# EasyEDA Pro project 2轴4.0--(02-06).eprj, board 2X-4.6-V3
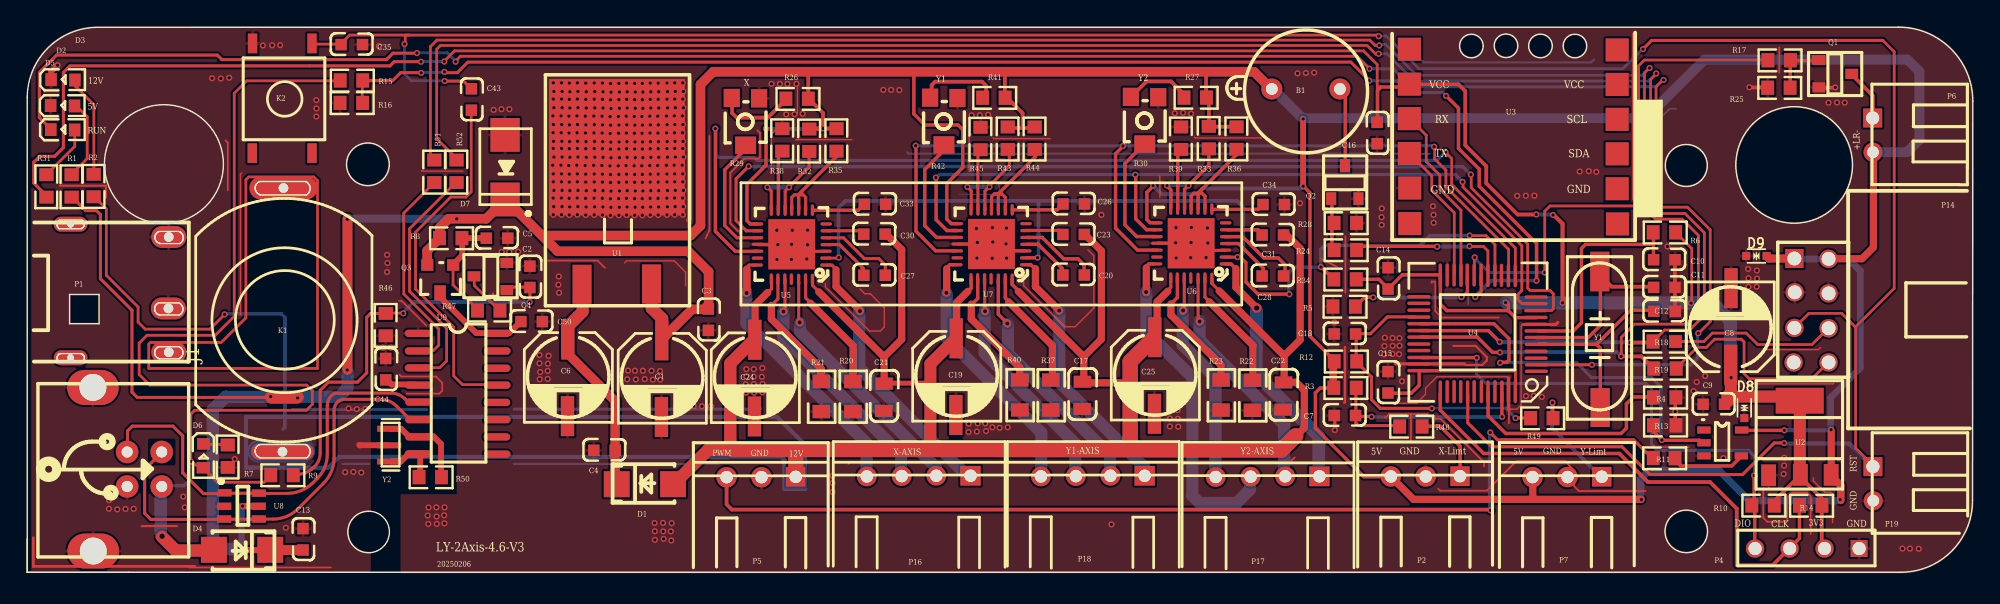
[diagram p1: board, top side]
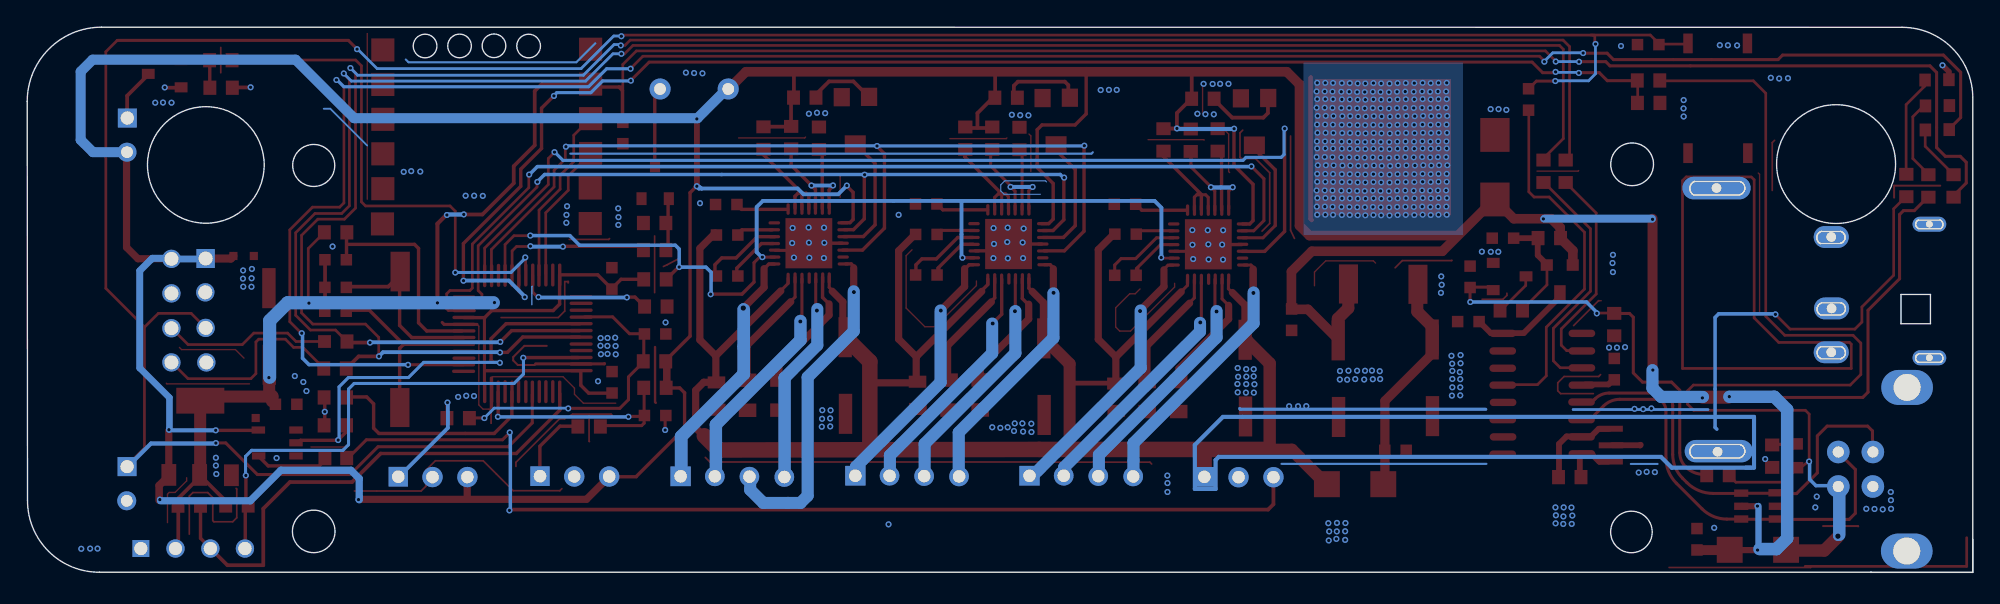
[diagram p2: board, bottom side, seen from below]

Outline 142.95 x 40.12 mm; copper layers: Top Layer, Bottom Layer. Coordinates in mm from the lower left corner of the outline.
Outline path: circle c10.04,30.05 r4.37 ; circle c25.03,30.03 r1.57 ; circle c25.08,2.97 r1.53 ; circle c106.11,38.73 r0.87 ; circle c108.65,38.75 r0.87 ; circle c111.18,38.74 r0.87 ; circle c113.72,38.73 r0.87 ; circle c121.9,29.95 r1.55 ; circle c121.9,3.02 r1.56 ; circle c129.83,29.98 r4.29 ; 0,2.47 0,0.01 137.66,0.01 arc(141.38,1.55) 142.93,5.28 142.95,34.66 arc(141.35,38.52) 137.49,40.12 5.2,40.11 arc(1.52,38.59) 0,34.91 0,0 7.49,0 7.49,0 ; 3.11,20.45 5.28,20.45 5.28,18.3 3.11,18.3 3.11,20.45
Stack: Top Layer 0.0356mm / Dielectric1 0.32mm FR-4 er 4.8 / Bottom Layer 0.0356mm

## Design rules (mm)
net R1: Top Side Components
net R2: Top Side Components
net R31: Top Side Components
net D3: Top Side Components
net D2: Top Side Components
net D5: Top Side Components
net P1: Top Side Components
net K1: Top Side Components
net K2: Top Side Components
net J1: Top Side Components
net D6: Top Side Components
net R7: Top Side Components
net R9: Top Side Components
net U8: Top Side Components
net D4: Top Side Components
net C13: Top Side Components
net Y2: Top Side Components
net R50: Top Side Components
net U9: Top Side Components
net C44: Top Side Components
net R46: Top Side Components
net Q3: Top Side Components
net Q4: Top Side Components
net R47: Top Side Components
net R8: Top Side Components
net R51: Top Side Components
net R52: Top Side Components
net C2: Top Side Components
net C5: Top Side Components
net C50: Top Side Components
net U1: Top Side Components
net D7: Top Side Components
net C43: Top Side Components
net C35: Top Side Components
net R15: Top Side Components
net R16: Top Side Components
net C6: Top Side Components
net C1: Top Side Components
net C24: Top Side Components
net C19: Top Side Components
net C25: Top Side Components
net C8: Top Side Components
net U5: Top Side Components
net U7: Top Side Components
net U6: Top Side Components
net U4: Top Side Components
net Y1: Top Side Components
net D1: Top Side Components
net C4: Top Side Components
net P5: Top Side Components
net P16: Top Side Components
net P18: Top Side Components
net P17: Top Side Components
net P2: Top Side Components
net P7: Top Side Components
net P4: Top Side Components
net P19: Top Side Components
net R10: Top Side Components
net R14: Top Side Components
net U2: Top Side Components
net P14: Top Side Components
net P6: Top Side Components
net Q1: Top Side Components
net U3: Top Side Components
net C3: Top Side Components
net R40: Top Side Components
net R37: Top Side Components
net R22: Top Side Components
net R23: Top Side Components
net C17: Top Side Components
net C22: Top Side Components
net C21: Top Side Components
net R20: Top Side Components
net R21: Top Side Components
net C27: Top Side Components
net C30: Top Side Components
net C33: Top Side Components
net C20: Top Side Components
net C23: Top Side Components
net C26: Top Side Components
net C28: Top Side Components
net C31: Top Side Components
net C34: Top Side Components
net C14: Top Side Components
net C18: Top Side Components
net C7: Top Side Components
net C15: Top Side Components
net C16: Top Side Components
net C9: Top Side Components
net C10: Top Side Components
net C11: Top Side Components
net C12: Top Side Components
net Q2: Top Side Components
net R29: Top Side Components
net R42: Top Side Components
net R30: Top Side Components
net B1: Top Side Components
net R26: Top Side Components
net R35: Top Side Components
net R38: Top Side Components
net R32: Top Side Components
net R44: Top Side Components
net R45: Top Side Components
net R41: Top Side Components
net R43: Top Side Components
net R27: Top Side Components
net R39: Top Side Components
net R33: Top Side Components
net R36: Top Side Components
net R28: Top Side Components
net R24: Top Side Components
net R34: Top Side Components
net R5: Top Side Components
net R12: Top Side Components
net R3: Top Side Components
net R48: Top Side Components
net R49: Top Side Components
net R18: Top Side Components
net R19: Top Side Components
net R4: Top Side Components
net R13: Top Side Components
net R11: Top Side Components
net U10: Top Side Components
net R6: Top Side Components
net R17: Top Side Components
net R25: Top Side Components
template: 用户自定义配置
spacing Clearance (default): track to track 0.201, other pairs 0.201 to 0.201
track width Width (default): min 0.1, default 0.254, max 10
differential pair DiffPairsRouting (default): width min 0.381, default 0.381, max 0.381; gap min 0.254, default 0.254
via RoutingVias (default): diameter min 1.27, default 1.27, max 1.27; hole min 0.711, default 0.711, max 0.711

## Placement (name value [footprint] x y rotation side)
B1  蜂鸣器  [B1]  92 35.62 0 top
C1  100uf 35v  [C1]  46.85 16.29 0 top
C2  104/50v 0603  [C13]  36.76 20.79 0 top
C3  -  [C13]  49.87 17.63 0 top
C4  104/50V 0603  [C13]  43.38 8.81 90 top
C5  103/50V 0603  [C13]  35.49 24.42 90 top
C6  100uf/35V  [C1]  39.95 16.35 0 top
C7  103/50V 0603  [C13]  97.78 11.37 90 top
C8  100uf/35V  [C1]  124.94 16.07 180 top
C9  -  [C13]  124.89 12.19 90 top
C10  -  [C13]  121.25 22.83 90 top
C11  -  [C13]  121.25 20.8 90 top
C12  -  [C13]  121.26 19.04 90 top
C13  -  [C13]  20.09 1.47 0 top
C14  104/50v 0603  [C13]  99.81 20.67 0 top
C15  104/50v 0603  [C13]  99.8 13.02 0 top
C16  104/50v 0603  [C13]  99.01 31.37 0 top
C17  105/50V 0805  [C17]  77.35 13.35 0 top
C18  103/50V 0603  [C13]  97.78 17.37 90 top
C19  100uf/35V  [C1]  68.48 16.44 0 top
C20  104/50v 0603  [C13]  77.85 21.71 90 top
C21  105/50V 0805  [C17]  62.78 13.21 0 top
C22  105/50V 0805  [C17]  92.13 13.29 0 top
C23  104/50v 0603  [C13]  77.85 24.69 90 top
C24  100uf/35V  [C1]  53.69 16.33 0 top
C25  100uf/35V  [C1]  83.08 16.52 0 top
C26  224/25V 0603  [C13]  77.86 26.93 90 top
C27  104/50v 0603  [C13]  63.23 21.69 90 top
C28  104/50v 0603  [C13]  92.49 21.63 90 top
C30  104/50v 0603  [C13]  63.21 24.71 90 top
C31  104/50v 0603  [C13]  92.49 24.65 90 top
C33  224/25V 0603  [C13]  63.26 26.91 90 top
C34  224/25V 0603  [C13]  92.55 26.89 90 top
C35  -  [C13]  24.81 38.66 90 top
C43  -  [C13]  32.46 33.84 0 top
C44  -  [C13]  26.16 13.99 0 top
C50  104/50v 0603  [C13]  38.03 18.28 90 top
D1  SS54/SMA  [D4]  47.4 6.67 180 top
D2  LED-R/0603  [D3]  3.65 34.43 0 top
D3  LED-R/0603  [D3]  3.68 36.33 0 top
D4  SS54/SMA  [D4]  13.77 1.48 0 top
D5  LED-G/0603  [D3]  3.66 32.66 0 top
D6  LED-R/0603  [D3]  13.03 7.52 270 top
D7  AE/SMB  [D7]  34.7 30.62 0 top
D8  PESD3V3L1BA-N  [SOD-523_L1.2-W0.8-LS1.6-BI]  126.16 12.11 90 top
D9  PESD5V0L1BA-N  [SOD-523_L1.2-W0.8-LS1.6-BI]  127.05 23.28 0 top
J1  4P USB  [J1]  9.73 9.8 0 top
K1  KAN-9A  [K1]  17.58 27.5 0 top
K2  6*6*11  [K2]  16.66 32.63 0 top
NOREF  -  [Pad_ie24]  18.67 8.92 180 top
P1  DC044A  [P1]  10.42 24.1 0 top
P2  3P  [P5]  104.76 6.75 0 top
P4  4P  [P4]  133.53 1.58 0 top
P5  3P  [P5]  55.95 6.7 0 top
P6  XH2.54-2P-90  [P19]  136.68 33.54 0 top
P7  3P  [P5]  115.18 6.71 0 top
P14  DC3-8P  [J10]  130.47 21.42 0 top
P16  4P  [P16]  68.75 6.22 0 top
P17  4P  [P16]  94.38 6.18 0 top
P18  4P  [P16]  81.54 6.22 0 top
P19  XH2.54-2P-90  [P19]  136.7 7.88 0 top
Q1  MMBT5551/SOT-23  [Q4]  131.67 37.55 180 top
Q2  MMBT5551/SOT-23  [Q4]  95.96 27.53 270 top
Q3  MMBT5401/SOT-23  [Q3]  30.51 22.24 0 top
Q4  MMBT5551/SOT-23  [Q4]  35.21 20.92 0 top
R1  1K/0603  [R31#2]  3.24 27.36 0 top
R2  2K/0603  [R31#2]  4.86 27.39 0 top
R3  -  [R31#2]  97.91 13.56 90 top
R4  -  [R31#2]  121.39 12.85 90 top
R5  -  [R31#2]  97.84 19.54 90 top
R6  -  [R31#2]  121.37 25 90 top
R7  1K/0603  [R31#2]  14.71 7.47 0 top
R8  10K/0603  [R31#2]  32.19 24.57 90 top
R9  2K/0603  [R31#2]  19.8 7.13 90 top
R10  -  [R31#2]  128.62 4.9 90 top
R11  100R/0603  [R31]  121.33 8.38 90 top
R12  -  [R31#2]  97.94 15.5 90 top
R13  2K/0603  [R31#2]  121.39 10.8 90 top
R14  -  [R31#2]  132.12 4.89 90 top
R15  5.1K/0603  [R31#2]  24.9 36.17 90 top
R16  -  [R31#2]  24.89 34.52 90 top
R17  2K/0603  [R31#2]  129.8 37.67 90 top
R18  100R/0603  [R31#3]  121.36 16.97 90 top
R19  100R/0603  [R31#2]  121.41 14.98 90 top
R20  R100/0805  [R40]  60.66 13.92 0 top
R21  R100/0805  [R40]  58.35 13.92 0 top
R22  R100/0805  [R40]  90.02 14.01 0 top
R23  R100/0805  [R40]  87.71 14.02 0 top
R24  2K/0603  [R31#2]  97.93 23.7 90 top
R25  -  [R31#2]  129.78 35.64 90 top
R26  30K/0603  [R31#2]  57.65 34.83 90 top
R27  30K/0603  [R31#2]  86.9 34.91 90 top
R28  -  [R31#2]  97.93 25.69 90 top
R29  3*3 10K  [R29]  54.66 34.81 0 top
R30  3*3 10K  [R29]  83.99 34.89 0 top
R31  1K/0603  [R31#2]  1.39 27.36 0 top
R32  -  [R31#2]  57.44 30.72 0 top
R33  -  [R31#2]  86.79 30.91 0 top
R34  -  [R31#2]  97.91 21.54 90 top
R35  100R/0603  [R31#2]  59.44 30.74 0 top
R36  100R/0603  [R31#2]  88.83 30.88 0 top
R37  R100/0805  [R40]  75.22 14.02 0 top
R38  10K/0603  [R31#2]  55.46 30.74 0 top
R39  10K/0603  [R31#2]  84.75 30.87 0 top
R40  R100/0805  [R40]  72.93 14.03 0 top
R41  30K/0603  [R31#2]  72.1 34.9 90 top
R42  3*3 10K  [R29]  69.24 34.83 0 top
R43  -  [R31#2]  72.02 30.87 0 top
R44  100R/0603  [R31#2]  74 30.87 0 top
R45  10K/0603  [R31#2]  70.02 30.85 0 top
R46  10K/0603  [R31#2]  26.32 17.16 0 top
R47  2K/0603  [R31#2]  34.99 19.25 90 top
R48  470R/0603  [R31#2]  102.74 10.71 90 top
R49  470R/0603  [R31#2]  112.36 11.32 90 top
R50  1M/0603  [R31#2]  30.69 6.98 90 top
R51  100R/0603  [R31#2]  29.89 28.44 0 top
R52  100R/0603  [R31#2]  31.52 28.44 0 top
U1  7805/TO263-3  [U1]  40.46 20.44 0 top
U2  1117-3.3/SOT-223  [U2]  128.18 7 0 top
U3  JY230  [U3]  101.73 38.24 0 top
U4  GD32F303CCT6  [U4]  110.99 14.98 0 top
U5  HR4988  [U5]  58.43 21.91 0 top
U6  HR4988  [U5]  87.78 21.99 0 top
U7  HR4988  [U5]  73.11 21.93 0 top
U8  UL26-SOT23-6  [U8]  14.37 6.21 0 top
U9  CH340G/SOP-16  [U9]  29.36 17.34 0 top
U10  74LVC1G17/SOT23-5  [V10]  123.78 10.22 0 top
Y1  8M/HC49S  [Y1]  114.99 20.94 0 top
Y2  12M  [Y2]  26.91 8.23 0 top

## Footprints (pads in the part's own frame, mm; a bottom-side part is the same pattern mirrored in y, then rotated)
B1
  round 1.548 hole 0.864: 1(-0.559,-0.051) 2(4.445,-0.051)
C1
  rect 0.984x2.949 smd: 1(-0.229,0.787) 2(-0.254,-4.851)
C13
  rect 0.848x0.848 smd: 1(0.178,0.178) 2(0.178,1.752)
C17
  rect 1.294x0.887 smd: 1(0.178,0.686) 2(0.152,-1.321)
D3
  rect 0.848x0.949 smd: 1(-0.178,-0.102) 2(-1.931,-0.076)
D4
  rect 1.903x1.915 smd: 1(-0.051,0.178) 2(4.09,0.178)
D7
  rect 2.152x2.492 smd: 1(0.406,1.575) 2(0.406,-3.175)
J1
  round 1.661 hole 0.813: 1(0.152,-3.48) 2(0.152,-0.94) 3(-2.388,-0.94) 4(-2.388,-3.48)
  oval 3.794x2.575 hole 1.981: 5(-4.902,3.81) 6(-4.877,-8.229)
J10
  rect 1.345x1.395 hole 1.016: 1(-0.635,1.677)
  round 1.345 hole 1.016: 2(1.879,1.651) 3(-0.61,-0.813) 4(1.879,-0.889) 5(-0.635,-3.429) 6(1.879,-3.454) 7(-0.686,-5.969) 8(1.879,-5.969)
K1
  oval 5.013x1.661 hole 0.711: 1(1.244,0.787)
  oval 4.6x1.2 hole 0.711: 2(1.169,-18.618)
K2
  rect 0.695x1.457 smd: 1(-0.127,-1.778) 2(4.267,-1.778) 3(4.267,6.299) 4(-0.102,6.299)
P1
  oval 2.575x1.609 hole 0.711: 1(-0.025,-7.899) 2(-0.051,-4.673) 3(-0.025,0.584)
  oval 2.473x1.101 hole 0.508: 4(-7.239,1.524) 5(-7.239,-8.306)
P4
  rect 1.243x1.243 hole 0.965: 1(1.067,0.178)
  round 1.345 hole 0.965: 2(-1.473,0.178) 3(-4.038,0.178) 4(-6.579,0.178)
P5
  rect 1.419x1.446 hole 0.914: 1(0.508,0.33)
  round 1.497 hole 0.914: 2(-2.006,0.305) 3(-4.572,0.305)
P16
  rect 1.497x1.446 hole 0.914: 1(0.559,0.889)
  round 1.446 hole 0.914: 2(-1.956,0.889) 3(-4.496,0.864) 4(-7.061,0.838)
P19
  rect 1.395x1.395 hole 0.965: 1(-1.092,-0.102)
  round 1.395 hole 0.864: 2(-1.067,-2.616)
Pad_ie24
  oval 5.002x1.649 smd far side: 6(0,0)
Q3
  rect 0.893x0.848 smd: 1(0.787,0.381) 2(-1.117,0.381)
  rect 0.848x1.147 smd: 3(-0.178,-1.677)
Q4
  rect 0.944x0.746 smd: 1(0.025,-0.152) 2(0.025,1.854) 3(-2.388,0.864)
R29
  rect 1.192x1.345 smd: 1(-0.889,0.076) 2(-2.896,0.102)
  rect 1.548x1.294 smd: 3(-1.879,-3.378)
R31
  rect 1.051x0.949 smd: 1(0.025,0.254) 2(0.036,1.852)
R31#2
  rect 1.051x0.949 smd: 1(0.025,0.254) 2(0.025,1.905)
R31#3
  rect 0.94x0.949 smd: 1(0.025,0.254)
  rect 1.051x0.949 smd: 2(0.025,1.905)
R40
  rect 1.294x0.989 smd: 1(0,0.127) 2(0,-2.083)
SOD-523_L1.2-W0.8-LS1.6-BI
  rect 0.6x0.6 smd: 1(-0.75,0) 2(0.75,0)
U1
  rect 1.401x2.88 smd: 1(0.305,0.762) 3(5.41,0.787)
  rect 9.986x10.043 smd: 2(2.87,10.846)
U2
  rect 1.091x1.599 smd: 1(-0.229,0.152) 2(2.108,0.178) 3(4.369,0.178)
  rect 3.529x1.903 smd: 4(2.058,5.639)
U3
  rect 1.7x1.7 smd: 1(-0.178,0.254) 2(-0.178,-2.312) 3(-0.178,-4.851) 4(-0.178,-7.417) 5(-0.152,-9.957) 6(-0.152,-12.573) 7(15.113,-12.598) 8(15.088,-10.008) 9(15.088,-7.442) 10(15.088,-4.902) 11(15.088,-2.337) 12(15.088,0.203)
U4
  oval 1.7x0.25 smd: 1(-0.102,-0.178) 2(-0.102,0.305) 3(-0.127,0.787) 4(-0.127,1.296) 5(-0.102,1.804) 6(-0.127,2.312) 7(-0.127,2.794) 8(-0.127,3.276) 9(-0.127,3.784) 10(-0.152,4.293) 11(-0.127,4.801) 12(-0.127,5.283) 25(-8.738,5.309) 26(-8.738,4.826) 27(-8.738,4.318) 28(-8.738,3.81) 29(-8.738,3.328) 30(-8.738,2.82) 31(-8.738,2.337) 32(-8.738,1.829) 33(-8.738,1.346) 34(-8.738,0.838) 35(-8.738,0.355) 36(-8.738,-0.127)
  oval 0.25x1.7 smd: 13(-1.651,6.858) 14(-2.159,6.858) 15(-2.667,6.883) 16(-3.15,6.883) 17(-3.658,6.883) 18(-4.165,6.909) 19(-4.673,6.909) 20(-5.181,6.909) 21(-5.639,6.883) 22(-6.147,6.909) 23(-6.655,6.909) 24(-7.163,6.909) 37(-7.163,-1.702) 38(-6.655,-1.677) 39(-6.147,-1.677) 40(-5.664,-1.677) 41(-5.156,-1.702) 42(-4.673,-1.677) 43(-4.14,-1.677) 44(-3.658,-1.702) 45(-3.15,-1.677) 46(-2.642,-1.702) 47(-2.159,-1.677) 48(-1.651,-1.677)
U5
  oval 0.85x0.24 smd: 1(0.254,0.711) 2(0.254,1.219) 3(0.254,1.727) 4(0.28,2.21) 5(0.28,2.718) 6(0.28,3.226) 7(0.28,3.734) 15(-4.775,3.734) 16(-4.775,3.226) 17(-4.775,2.718) 18(-4.775,2.235) 19(-4.775,1.727) 20(-4.775,1.219) 21(-4.801,0.711)
  oval 0.24x0.85 smd: 8(-0.737,4.75) 9(-1.244,4.75) 10(-1.752,4.75) 11(-2.26,4.75) 12(-2.743,4.75) 13(-3.251,4.75) 14(-3.759,4.75) 22(-3.759,-0.33) 23(-3.276,-0.33) 24(-2.768,-0.33) 25(-2.286,-0.33) 26(-1.752,-0.355) 27(-1.244,-0.33) 28(-0.737,-0.355)
  rect 3.441x3.695 smd: 29(-2.26,2.235)
U8
  rect 1.04x0.543 smd: 1(0.127,-0.355) 2(0.102,-1.346) 3(0.102,-2.286) 4(2.642,-2.286) 5(2.642,-1.346) 6(2.642,-0.381)
U9
  oval 1.96x0.543 smd: 1(-0.635,0.254) 2(-0.635,-1.042) 3(-0.635,-2.286) 4(-0.635,-3.556) 5(-0.61,-4.801) 6(-0.61,-6.096) 7(-0.61,-7.366) 8(-0.635,-8.611) 9(5.181,-8.636) 10(5.156,-7.366) 11(5.181,-6.096) 12(5.156,-4.826) 13(5.181,-3.556) 14(5.181,-2.312) 15(5.181,-1.042) 16(5.181,0.254)
V10
  rect 0.989x0.531 smd: 1(-0.584,0.254) 2(-0.584,-0.686) 3(-0.584,-1.651) 4(2.159,-1.651) 5(2.184,0.254)
Y1
  rect 1.419x2.919 smd: 1(0.559,1.194)
  rect 1.419x2.869 smd: 2(0.584,-8.814)
Y2
  rect 1.8x0.441 smd: 1(-0.305,-0.076) 2(-0.33,1.117) 3(-0.305,2.337)

## Nets
V10-1: U10.1
D3-2: C1.2 C2.2 C3.1 C4.2 C5.1 C6.2 C7.2 C8.2 C9.2 C10.1 C11.1 C12.1 C13.2 C14.2 C15.2 C16.1 C17.2 C18.2 C19.2 C21.2 C22.2 C24.2 C25.2 C26.1 C33.1 C34.1 C35.1 C44.2 C50.1 D2.2 D3.2 D7.1 D8.1 D9.1 J1.4 J1.5 J1.6 K2.4 P1.2 P1.3 P2.2 P4.1 P5.2 P7.2 P14.3 P14.4 P19.2 Q1.2 Q2.2 Q4.2 R4.1 R5.2 R7.1 R13.1 R16.2 R20.2 R21.2 R22.2 R23.2 R25.2 R28.1 R29.1 R30.1 R37.2 R38.2 R39.2 R40.2 R42.1 R45.2 R46.1 U1.2 U2.1 U3.5 U4.8 U4.23 U4.35 U4.47 U5.3 U5.18 U5.29 U6.3 U6.18 U6.29 U7.3 U7.18 U7.29 U8.2 U9.1 U10.3 Y2.2
D5-2: D5.2 U4.2
D6-2: D6.2 R7.2
J1-1: J1.1 U8.3 U8.4 U9.6
J1-2: D4.1 D6.1 J1.2 R9.2 R15.2
J1-3: J1.3 U8.1 U8.6 U9.5
K2-1: K2.1
K2-2: K2.2
K2-3: C35.2 C43.2 K2.3 P14.5 P19.1 U4.41
P1-1: K1.1 P1.1
P1-4: P1.4
P1-5: P1.5
P2-1: P2.1 R48.1
P5-3: P5.3 R11.2
P6-1: P6.1 Q1.3
P7-1: P7.1 R49.1
P14-6: P14.6 R18.1
P14-7: P14.7
P14-8: P14.8 R19.1
Q1-1: Q1.1 R17.1 R25.1
Q2-1: Q2.1 R24.2 R28.2
Q2-3: B1.2 Q2.3
Q3-1: C5.2 Q3.1 R8.1 R47.2
Q4-3: Q4.3 R47.1
R1-1: B1.1 C1.1 C3.2 C13.1 D4.2 D7.2 D9.2 P2.3 P6.2 P7.3 P14.1 P14.2 Q3.2 R1.1 R3.2 R8.2 R12.2 R26.1 R27.1 R32.2 R33.2 R35.2 R36.2 R41.1 R43.2 R44.2 U1.3 U2.3 U5.15 U6.15 U7.15 U8.5 U10.5
R1-2: D2.1 R1.2
R2-1: C17.1 C19.1 C21.1 C22.1 C23.1 C24.1 C25.1 C30.1 C31.1 D1.1 K1.2 NOREF.6 P5.1 R2.1 U5.22 U5.28 U6.22 U6.28 U7.22 U7.28
R2-2: D3.1 R2.2
R9-1: C2.1 Q4.1 R9.1 R46.2
R15-1: R15.1 R16.1 U4.18
R29-2: R26.2 R29.2
R30-2: R27.2 R30.2
R31-1: C8.1 C9.1 C14.1 C15.1 C16.2 D8.2 P4.2 R6.1 R10.1 R14.1 R31.1 R34.1 U2.2 U2.4 U3.2 U4.9 U4.24 U4.36 U4.48
R31-2: D5.1 R31.2
R42-2: R41.2 R42.2
R51-2: R19.2 R51.2 U4.31
R52-2: R18.2 R52.2 U4.30
U1-1: C4.1 C6.1 D1.2 U1.1
U3-1: U3.1
U3-6: U3.6
U3-7: U3.7
U3-8: U3.8
U3-9: U3.9
U3-10: U3.10
U3-11: U3.11
U3-12: U3.12
U4-1: U4.1
U4-3: U4.3
U4-4: U4.4
U4-5: C12.2 U4.5 Y1.2
U4-6: C11.2 U4.6 Y1.1
U4-7: C10.2 R6.2 U4.7
U4-12: U4.12
U4-15: U4.15
U4-17: R24.1 U4.17
U4-19: R17.2 U4.19
U4-20: R5.1 U4.20
U4-21: U3.3 U4.21
U4-22: U3.4 U4.22
U4-25: U4.25
U4-26: U4.26
U4-27: U4.27
U4-28: C18.1 R12.1 R49.2 U4.28
U4-29: R13.2 U4.29 U10.2
U4-32: U4.32
U4-33: U4.33
U4-34: P4.4 R10.2 U4.34
U4-37: P4.3 R14.2 U4.37
U4-38: U4.38
U4-39: U4.39
U4-40: U4.40
U4-42: U4.42
U4-43: U4.43
U4-44: R4.2 U4.44
U4-45: U4.45
U4-46: C7.1 R3.1 R48.2 U4.46
U5-1: P16.1 U5.1
U5-2: R34.2 U4.16 U5.2 U6.2 U7.2
U5-4: C27.2 U5.4
U5-5: C27.1 U5.5
U5-6: C30.2 U5.6
U5-7: U5.7
U5-8: C33.2 U5.8
U5-9: R35.1 U5.9 U5.10 U5.11
U5-12: R32.1 U5.12 U5.14
U5-13: R38.1 U5.13
U5-16: U4.10 U5.16
U5-17: R29.3 U5.17
U5-19: U4.13 U5.19
U5-20: U5.20
U5-21: P16.4 U5.21
U5-23: R21.1 U5.23
U5-24: P16.3 U5.24
U5-25: U5.25
U5-26: P16.2 U5.26
U5-27: R20.1 U5.27
U6-1: P17.1 U6.1
U6-4: C28.2 U6.4
U6-5: C28.1 U6.5
U6-6: C31.2 U6.6
U6-7: U6.7
U6-8: C34.2 U6.8
U6-9: R36.1 U6.9 U6.10 U6.11
U6-12: R33.1 U6.12 U6.14
U6-13: R39.1 U6.13
U6-17: R30.3 U6.17
U6-20: U6.20
U6-21: P17.3 U6.21
U6-23: R23.1 U6.23
U6-24: P17.4 U6.24
U6-25: U6.25
U6-26: P17.2 U6.26
U6-27: R22.1 U6.27
U7-1: P18.1 U7.1
U7-4: C20.2 U7.4
U7-5: C20.1 U7.5
U7-6: C23.2 U7.6
U7-7: U7.7
U7-8: C26.2 U7.8
U7-9: R44.1 U7.9 U7.10 U7.11
U7-12: R43.1 U7.12 U7.14
U7-13: R45.1 U7.13
U7-16: U4.11 U6.16 U7.16
U7-17: R42.3 U7.17
U7-19: U4.14 U6.19 U7.19
U7-20: U7.20
U7-21: P18.4 U7.21
U7-23: R40.1 U7.23
U7-24: P18.3 U7.24
U7-25: U7.25
U7-26: P18.2 U7.26
U7-27: R37.1 U7.27
U9-2: R51.1 U9.2
U9-3: R52.1 U9.3
U9-4: C44.1 U9.4
U9-9: U9.9
U9-10: U9.10
U9-11: U9.11
U9-12: U9.12
U9-13: C43.1 U9.13
U9-14: U9.14
U9-15: U9.15
U9-16: C50.2 Q3.3 U9.16
UNNAMEDNET1: R11.1 U10.4
Y2-1: R50.2 U9.8 Y2.1
Y2-3: R50.1 U9.7 Y2.3

## Via types
v1: diameter 0.45, hole 0.25, Top Layer to Bottom Layer, 597 vias
v2: diameter 0.7, hole 0.4, Top Layer to Bottom Layer, 2 vias
v3: diameter 0.6, hole 0.3, Top Layer to Bottom Layer, 11 vias

## Routing (per net, layer and track width the routed paths; a pad name or vN(x,y) marks a point on that pad's centre or on a via; arc(x,y) is an arc through that point)
D3-2: length 431.8
  Top Layer w0.074: 117.95,39.66 117.96,39.64
  Top Layer w0.099: 48.37,21.09 48.37,22.1 47.54,22.92 44.04,22.92 43.88,22.76 ; 15.76,29.39 15.67,29.29 15.67,18.94 ; 70.96,31.97 71.02,31.92 75.16,31.92 ; 77.94,23.74 78.37,23.3 78.37,19.45 77,18.08 76.23,18.08 73.21,21.1 73.21,21.44 ; 83.2,29.18 83.22,29.16 83.22,27.6 ; 90.68,31.97 85.82,31.97 85.76,32.04 ; 61.19,20.86 61.55,20.5 61.95,20.5 62.97,19.47 62.97,18.06 62.68,17.76 61.88,17.76 58.64,21 58.64,21.27 ; 32.02,29.53 29,29.53 28.96,29.57 ; 60.59,31.84 56.51,31.84 56.48,31.81 ; 56.54,35.94 56.59,35.89 56.59,33.78 ; 54.6,29.42 54.68,29.5 54.68,32.26 55.12,32.7 ; 109.9,18.25 109.77,18.12 109.77,12.32 109.46,12.01 109.02,12.01 108.86,11.85 108.86,10.96 108.86,12.06 ; 69.21,29.51 69.21,32.12 69.35,32.26 ; 27.3,19.99 27.47,19.99
  Top Layer w0.1: 99.71,12.45 102.08,12.45 102.74,13.11 102.74,13.56 103.58,14.4 108.74,14.4 108.84,14.3 ; 127.02,15.77 127.65,16.39 131.61,16.39 131.77,16.55 ; 132.64,3.66 132.64,5.76 132.52,5.88 132.08,5.88 131.24,6.73 131.24,6.96 ; 122.1,9.23 119.64,9.23 119.5,9.37 ; 132.73,13.92 132.69,13.87 126.62,13.87 ; 117.96,27.46 117.96,39.64
  Top Layer w0.124: 27.88,13.16 30.28,13.16 30.49,13.37 30.49,13.95 30.03,14.41 27.49,14.41 27.35,14.55 ; 100.16,24.56 100.23,24.5 103.13,24.5 ; 38.27,22.97 38.29,22.94 41.91,22.94 42.44,22.42 ; 14.57,31.79 14.73,31.62 14.73,28.11 ; 11.8,0.48 11.92,0.36 22.31,0.36 ; 103.2,21.4 103.45,21.4 103.45,19.23 103.93,18.75 108.13,18.75 ; 95.08,23.08 95.93,22.64 96.21,22.51 ; 27.47,19.99 27.5,19.99 29.33,18.16 ; 50.13,32.11 50.13,25.18 49.84,24.57 ; 53.64,32.54 53.84,32.34 53.84,30.55 53.73,30.45 52.7,30.45 51.66,29.41 51.66,25.67 52.22,25.11 ; 36.05,20.1 34.52,20.1 34.23,20.38 34.23,20.54 ; 96.85,20.58 96.85,24.75
  Top Layer w0.126: 127.6,6.18 127.55,6.13 127.55,4.02 127.85,3.73 129.23,3.73 129.32,3.81 129.32,5.5 129.69,5.87 130.78,5.87 131.04,5.61 131.04,2.81 ; 101.67,11.61 101.67,9.65 101.64,9.63 ; 128.73,36.77 128.73,38.63 ; 118.91,5.99 114.01,5.99 113.67,6.33 113.67,7.5 112.96,8.21 109.45,8.21 108.48,7.25 107.24,6.01 103.81,6.01 103.67,6.16 ; 60.33,7.98 60.47,8.11 67.84,8.11 67.85,8.12 92.79,8.12 93.13,8.46 ; 99.79,11.38 100.05,11.65 102.87,11.65 103.47,11.3 103.84,11.3 107.04,8.1 107.04,7.8
  Top Layer w0.149: 104.78,16.67 106.42,16.67 107.24,15.84 107.24,15.6 106.91,15.26 105.68,15.26 105.59,15.35 ; 11,3.41 8.44,3.41 8.42,3.39 ; 2.39,28.46 5.78,28.46 5.78,27.58 ; 103.2,21.31 103.2,21.4
  Top Layer w0.174: 96.77,12.48 96.82,12.53 96.82,16.58
  Top Layer w0.2: 12.31,0.44 0.45,0.44 0.45,2.55
  Top Layer w0.226: 109.9,18.25 112.32,18.25 112.46,18.39 ; 105.59,15.35 100.55,15.35 100.53,15.37 ; 96.08,11.49 96.08,10.5 96.04,10.46 ; 86.62,23.7 87.99,23.7 ; 108.84,12.09 108.86,12.06 ; 57.55,23.63 58.64,23.63
  Top Layer w0.251: 121.13,10.9 121.09,10.95 121.09,12.75 ; 53.71,24.12 54.89,24.12 ; 83.07,24.22 84.13,24.22 ; 72.13,23.66 73.29,23.66 ; 108.84,12.09 108.84,14.3 ; 68.41,24.16 69.75,24.16
  Top Layer w0.276: 127.77,35.69 126.57,35.69 126.57,35.69 ; 121.07,19.13 121.07,22.91 ; 131.75,35.67 132.86,35.67
  Top Layer w0.301: 48.56,25.92 48.65,26.01
  Top Layer w0.327: 48.65,26.01 48.65,36.43
  Top Layer w0.4: v1(2.23,37.32) 1.75,36.84 1.75,36.26
  Top Layer w0.428: 26.49,9.36 24.45,9.36 24.44,9.34 24.4,9.39
  Bottom Layer w0.073: 68.05,28.73 68.13,28.81 71.12,28.81 71.42,28.52 71.42,28.07 71.17,27.82 68.5,27.82
  Bottom Layer w0.099: 105.87,19.71 105.87,21.02 105.85,21.05
  Bottom Layer w0.124: 121.17,34.12 120.68,34.12 117.97,31.41
  Bottom Layer w0.149: 115.13,37.74 114.93,37.54 102.6,37.54 101.21,38.94 ; 64.66,30.91 64.76,30.81 103.04,30.81 ; 23.17,7.98 25.12,7.98 ; 35.73,7.99 50.79,7.99
  Bottom Layer w0.2: 19.46,11.98 29.36,11.98
  Bottom Layer w0.226: 53.87,12.06 53.81,12 35.79,12
  vias: v1(6.02,5.92) v1(6.01,5.31) v1(6,4.68) v1(6.62,4.64) v1(7.22,4.67) v1(7.82,4.68) v1(11.46,5.58) v1(11.57,4.78) v1(13.58,36.36) v1(14.23,36.34) v1(14.84,36.4) v1(15.25,8.34) v1(17.32,38.78) v1(17.99,38.79) v1(18.59,38.8) v1(19,3.28) v1(21.24,34.76) v1(21.25,34.14) v1(21.24,33.55) v1(23.36,7.38) v1(23.61,12.06) v1(23.96,7.4) v1(24.22,12.01) v1(24.55,7.34) v1(24.85,12.03) v1(25.55,16.57) v1(25.85,38.73) v1(26.14,16.54) v1(26.44,23.37) v1(26.47,22.76) v1(26.44,22.1) v1(26.73,16.54) v1(29.49,4.77) v1(29.42,4.18) v1(29.47,3.57) v1(30.06,4.78) v1(30.08,4.12) v1(30.09,3.57) v1(30.66,4.78) v1(30.63,4.2) v1(30.65,3.61) v1(34.27,34.04) v1(34.84,34.09) v1(34.86,23.59) v1(35.42,34.09) v1(35.41,23.59) v1(36.07,23.6) v1(37.64,15.99) v1(37.64,15.39) v1(37.66,14.21) v1(37.66,13.62) v1(37.66,13.03) v1(37.69,14.74) v1(38.25,15.36) v1(38.24,14.83) v1(38.24,14.23) v1(38.24,13.62) v1(38.27,13.01) v1(38.3,15.94) v1(38.65,36.03) v1(38.65,34.83) v1(38.62,33.59) v1(38.66,32.96) v1(38.63,32.35) v1(38.67,31.72) v1(38.65,31.2) v1(38.61,29.96) v1(38.65,29.33) v1(38.65,28.74) v1(38.64,27.55) v1(38.69,26.91) v1(38.65,26.32) v1(38.7,35.39) v1(38.7,34.19) v1(38.7,30.56) v1(38.7,28.11) v1(39.06,21.78) v1(39.02,21.17) v1(39.08,20.57) v1(39.26,36.03) v1(39.26,34.83) v1(39.22,33.59) v1(39.27,32.96) v1(39.23,32.35) v1(39.28,31.72) v1(39.26,31.2) v1(39.21,29.96) v1(39.26,29.33) v1(39.26,28.74) v1(39.25,27.55) v1(39.29,26.91) v1(39.26,26.32) v1(39.3,35.39) v1(39.3,34.19) v1(39.3,30.56) v1(39.3,28.11) v1(39.79,29.94) v1(39.83,36) v1(39.87,35.37) v1(39.83,34.81) v1(39.87,34.17) v1(39.8,33.57) v1(39.84,32.94) v1(39.81,32.33) v1(39.85,31.7) v1(39.83,31.18) v1(39.87,30.54) v1(39.83,29.31) v1(39.83,28.72) v1(39.87,28.09) v1(39.82,27.53) v1(39.86,26.89) v1(39.83,26.3) v1(40.38,29.96) v1(40.42,36.03) v1(40.46,35.39) v1(40.42,34.83) v1(40.46,34.19) v1(40.39,33.59) v1(40.43,32.96) v1(40.4,32.35) v1(40.44,31.72) v1(40.42,31.2) v1(40.46,30.56) v1(40.42,29.33) v1(40.42,28.74) v1(40.46,28.11) v1(40.41,27.55) v1(40.45,26.91) v1(40.42,26.32) v1(41.03,36) v1(41.08,35.37) v1(41.03,34.81) v1(41.08,34.17) v1(41,33.57) v1(41.05,32.94) v1(41.01,32.33) v1(41.06,31.7) v1(41.03,31.18) v1(41.08,30.54) v1(40.99,29.94) v1(41.03,29.31) v1(41.03,28.72) v1(41.08,28.09) v1(41.02,27.53) v1(41.07,26.89) v1(41.03,26.3) v1(41.66,36.02) v1(41.66,34.82) v1(41.63,33.58) v1(41.67,32.95) v1(41.64,32.34) v1(41.68,31.71) v1(41.66,31.19) v1(41.62,29.95) v1(41.66,29.32) v1(41.66,28.73) v1(41.65,27.54) v1(41.66,26.31) v1(41.7,35.38) v1(41.7,34.18) v1(41.7,30.55) v1(41.7,28.1) v1(41.69,26.9) v1(42.26,36) v1(42.26,34.81) v1(42.23,33.57) v1(42.27,32.94) v1(42.24,32.33) v1(42.28,31.7) v1(42.26,31.18) v1(42.22,29.94) v1(42.26,29.31) v1(42.26,28.72) v1(42.25,27.53) v1(42.26,26.3) v1(42.3,35.37) v1(42.3,34.17) v1(42.3,30.54) v1(42.3,28.09) v1(42.29,26.89) v1(42.85,35.97) v1(42.85,34.78) v1(42.82,33.54) v1(42.87,32.9) v1(42.83,32.3) v1(42.88,31.67) v1(42.85,31.15) v1(42.81,29.91) v1(42.85,29.27) v1(42.85,28.69) v1(42.84,27.5) v1(42.89,26.86) v1(42.85,26.27) v1(42.9,35.34) v1(42.9,34.14) v1(42.9,30.51) v1(42.9,28.06) v1(43.47,35.98) v1(43.47,34.79) v1(43.44,33.55) v1(43.48,32.91) v1(43.45,32.31) v1(43.47,31.16) v1(43.43,29.92) v1(43.47,29.28) v1(43.47,28.7) v1(43.46,27.51) v1(43.47,26.28) v1(43.51,35.35) v1(43.51,34.15) v1(43.49,31.68) v1(43.51,30.52) v1(43.51,28.07) v1(43.5,26.87) v1(43.57,14.81) v1(43.54,14.22) v1(44.04,36) v1(44.08,35.37) v1(44.04,34.81) v1(44.08,34.17) v1(44.01,33.57) v1(44.05,32.94) v1(44.02,32.33) v1(44.06,31.7) v1(44.04,31.18) v1(44.08,30.54) v1(44,29.94) v1(44.04,29.31) v1(44.04,28.72) v1(44.08,28.09) v1(44.03,27.53) v1(44.07,26.89) v1(44.04,26.3) v1(44.08,14.21) v1(44.15,14.85) v1(44.63,35.98) v1(44.67,35.35) v1(44.63,34.79) v1(44.67,34.15) v1(44.6,33.55) v1(44.64,32.91) v1(44.61,32.31) v1(44.65,31.68) v1(44.63,31.16) v1(44.67,30.52) v1(44.59,29.92) v1(44.63,29.28) v1(44.63,28.7) v1(44.67,28.07) v1(44.62,27.51) v1(44.66,26.87) v1(44.63,26.28) v1(44.65,14.84) v1(44.72,14.19) v1(45.16,33.55) v1(45.17,32.31) v1(45.15,29.92) v1(45.18,27.51) v1(45.19,35.98) v1(45.24,35.35) v1(45.19,34.79) v1(45.24,34.15) v1(45.2,32.91) v1(45.22,31.68) v1(45.19,31.16) v1(45.24,30.52) v1(45.19,29.28) v1(45.19,28.7) v1(45.24,28.07) v1(45.23,26.87) v1(45.19,26.28) v1(45.24,14.84) v1(45.37,14.22) v1(45.78,36) v1(45.78,34.81) v1(45.74,33.57) v1(45.79,32.94) v1(45.75,32.33) v1(45.78,31.18) v1(45.73,29.94) v1(45.78,29.31) v1(45.78,28.72) v1(45.77,27.53) v1(45.78,26.3) v1(45.82,35.37) v1(45.82,34.17) v1(45.8,31.7) v1(45.82,30.54) v1(45.82,28.09) v1(45.81,26.89) v1(45.87,14.84) v1(45.97,14.18) v1(46.09,3.63) v1(46.11,3.03) v1(46.11,2.39) v1(46.36,36) v1(46.36,34.81) v1(46.33,33.57) v1(46.37,32.94) v1(46.34,32.33) v1(46.38,31.7) v1(46.36,31.18) v1(46.32,29.94) v1(46.36,29.31) v1(46.36,28.72) v1(46.35,27.53) v1(46.36,26.3) v1(46.4,35.37) v1(46.4,34.17) v1(46.4,30.54) v1(46.4,28.09) v1(46.39,26.89) v1(46.5,14.82) v1(46.51,14.19) v1(46.72,3.64) v1(46.73,3.02) v1(46.76,2.47) v1(46.97,33.58) v1(46.98,32.34) v1(46.96,29.95) v1(47,36.02) v1(47.05,35.38) v1(47,34.82) v1(47.05,34.18) v1(47.01,32.95) v1(47.02,31.71) v1(47,31.19) v1(47.05,30.55) v1(47,29.32) v1(47,28.73) v1(47.05,28.1) v1(46.99,27.54) v1(47.03,26.9) v1(47,26.31) v1(47.35,3.62) v1(47.29,3.02) v1(47.32,2.35) v1(47.58,36.03) v1(47.58,34.83) v1(47.54,33.59) v1(47.59,32.96) v1(47.55,32.35) v1(47.58,31.2) v1(47.53,29.96) v1(47.58,29.33) v1(47.58,28.74) v1(47.56,27.55) v1(47.58,26.32) v1(47.62,35.39) v1(47.62,34.19) v1(47.6,31.72) v1(47.62,30.56) v1(47.62,28.11) v1(47.61,26.91) v1(48.17,36.03) v1(48.17,34.83) v1(48.14,33.59) v1(48.18,32.96) v1(48.15,32.35) v1(48.17,31.2) v1(48.12,29.96) v1(48.17,29.33) v1(48.17,28.74) v1(48.16,27.55) v1(48.17,26.32) v1(48.21,35.39) v1(48.21,34.19) v1(48.19,31.72) v1(48.21,30.56) v1(48.21,28.11) v1(48.2,26.91) v1(48.97,12.23) v1(49.58,12.22) v1(50.23,12.22) v1(52.78,13.84) v1(52.84,14.95) v1(52.84,14.42) v1(52.82,13.23) v1(53.39,14.95) v1(53.37,14.4) v1(53.39,13.85) v1(53.41,13.23) v1(53.98,14.39) v1(54.01,15.04) v1(54.03,13.86) v1(54.01,13.25) v1(54.69,35.95) v1(55.08,25.18) v1(55.15,24.12) v1(55.09,23.02) v1(55.3,35.95) v1(55.77,33.71) v1(55.85,35.94) v1(56.17,24.14) v1(56.15,23.03) v1(56.21,25.18) v1(56.38,33.72) v1(56.52,35.95) v1(56.97,33.75) v1(57.28,23.06) v1(57.34,25.19) v1(57.33,24.11) v1(59.18,7.12) v1(59.17,6.57) v1(59.17,5.92) v1(62.9,35.51) v1(63.47,35.51) v1(64.07,35.5) v1(69.18,10.94) v1(69.17,10.33) v1(69.39,33.63) v1(69.74,25.3) v1(69.78,23.12) v1(69.78,10.36) v1(69.81,24.28) v1(69.83,10.96) v1(69.99,33.64) v1(70.39,10.96) v1(70.45,10.4) v1(70.6,33.68) v1(70.91,25.37) v1(70.94,24.31) v1(70.9,23.11) v1(70.91,10.68) v1(71.45,10.64) v1(71.95,25.34) v1(71.92,24.17) v1(71.96,23.12) v1(72.04,10.68) v1(78.92,26.31) v1(79.66,3.53) v1(83.92,11.93) v1(83.95,11.33) v1(83.95,10.74) v1(84.32,33.79) v1(84.38,24.26) v1(84.41,25.37) v1(84.42,23.14) v1(84.53,11.93) v1(84.55,11.3) v1(84.57,10.72) v1(84.92,33.82) v1(85.48,23.16) v1(85.52,33.75) v1(85.54,25.38) v1(85.52,24.27) v1(86.62,23.17) v1(86.71,25.35) v1(86.74,24.24) v1(93.34,36.72) v1(93.52,27.17) v1(93.95,36.75) v1(94.55,36.78) v1(96.05,18.39) v1(96.08,10.48) v1(99.53,26.79) v1(99.51,26.14) v1(99.52,25.57) v1(99.75,17.27) v1(99.72,16.66) v1(99.71,16.04) v1(100.31,17.25) v1(100.32,16.67) v1(100.31,16.08) v1(100.82,17.24) v1(100.83,16.68) v1(100.8,16.06) v1(101.01,14.06) v1(103.29,26.95) v1(103.33,26.31) v1(103.34,25.73) v1(109.48,27.71) v1(110.11,27.72) v1(110.12,12.97) v1(110.74,27.72) v1(110.69,13) v1(111.29,12.91) v1(114.07,29.5) v1(114.74,29.53) v1(115.29,29.47) v1(120.52,23.98) v1(121.09,11.82) v1(122.43,13.34) v1(122.66,14.01) v1(123.29,14.45) v1(124.63,8.41) v1(126.44,22.33) v1(126.46,21.64) v1(126.47,21.02) v1(126.54,35.7) v1(127.09,22.22) v1(127.08,21.02) v1(127.1,21.62) v1(129.09,8.44) v1(129.09,7.86) v1(129.06,7.24) v1(132.35,34.56) v1(132.85,35.69) v1(132.97,34.58) v1(133.54,34.56) v1(137.78,1.75) v1(138.33,1.75) v1(138.98,1.74)
D5-2: length 162.4
  Top Layer w0.2: 98.66,37.04 97.71,37.98 31.83,37.98 31.49,37.64 31.49,37.57 ; 122.81,17.59 122.81,17.61 123.66,18.45 123.66,25.2 121.99,26.88 119.99,26.88 119.68,27.19 119.68,35.75 120.18,36.24
  Top Layer w0.226: 1.71,32.59 1.71,32.65 0.89,33.47 0.89,36.8 2.16,38.07 13.97,38.07 14.31,37.73 26.4,37.73 26.87,38.21 28.69,38.21 ; 110.89,15.28 115,15.28
  Bottom Layer w0.2: 28.63,38.21 28.65,38.23 30.86,38.23 31.51,37.58
  Bottom Layer w0.226: 98.61,37.06 100.38,37.06 101.7,35.74 119.69,35.74 120.19,36.25
  Bottom Layer w0.251: 114.94,15.26 114.97,15.29 122.25,15.29 122.72,15.76 122.72,17.57
  vias: v1(28.63,38.22) v1(31.48,37.58) v1(98.62,37.06) v1(114.97,15.27) v1(120.23,36.24) v1(122.78,17.6)
D6-2: length 1.9
  Top Layer w0.226: 12.94,9.47 12.99,9.42 14.77,9.42
J1-1: length 31.7
  Top Layer w0.226: 9.69,8.63 8.63,7.57 8.63,4.35 9.08,3.9 14.3,3.9 14.31,3.91 16.99,3.91 17.05,3.97 arc(17.11,3.93) 17.18,3.92 18.07,3.92 arc(19.06,4.12) 19.89,4.68 21.78,6.56 arc(22.35,7.41) 22.55,8.41 22.55,11.9 arc(22.62,12.26) 22.83,12.57 arc(23.01,12.69) 23.22,12.74 25.93,12.74 arc(26.58,12.61) 27.14,12.24 27.87,11.51 arc(28.19,11.29) 28.56,11.22
J1-2: length 80
  Top Layer w0.2: 22.97,36.17 16.13,36.17 15.21,35.26 15.21,18.84 13.81,17.45 8.8,17.45 8.23,16.88 8.23,14.56 9,13.78 20.53,13.78 20.95,13.36 20.95,12.37 20.51,11.93 12.3,11.93 12.02,11.65 12.02,8.21 12.05,8.19 12.7,7.67 12.94,7.67 13.97,6.64 17.41,6.64 17.89,7.12
  Top Layer w0.226: 17.89,7.12 17.89,7.36
  Top Layer w0.886: 13.61,1.61 13.68,1.67
  Top Layer w0.911: 13.61,1.61 10.91,1.61 9.91,2.61
  Bottom Layer w0.251: 9.85,6.47 9.94,6.38 11.52,6.38 11.99,6.85 11.99,8.15
  Bottom Layer w0.911: 9.84,6.36 9.81,6.33 9.81,2.77
  vias: v1(12.03,8.16) v2(9.91,2.66)
J1-3: length 32.9
  Top Layer w0.226: 28.84,12.57 28.21,12.57 arc(27.97,12.62) 27.77,12.75 27.76,12.76 arc(27.28,13.08) 26.71,13.2 22.79,13.2 arc(22.55,13.15) 22.36,13.02 arc(22.13,12.68) 22.05,12.28 22.05,8.67 arc(21.86,7.73) 21.33,6.93 21.01,6.61 arc(20.12,6.02) 19.08,5.81 17.06,5.81 17.05,5.82 14.4,5.82 14.38,5.8 12.95,5.8 11.42,7.32 11.42,10.04 10.7,10.76 7.72,10.76 7.37,10.41 7.37,8.77 7.4,8.74
K2-3: length 200.5
  Top Layer w0.2: 99.35,39.4 99.21,39.54 27.91,39.54 ; 27.92,39.53 27.77,39.53 27.77,38.97 27.75,38.94 ; 20.95,38.87 20.95,38.88 23.32,38.88 23.32,39.17 23.69,39.54 28.08,39.54 ; 129.91,17.84 129.91,18.07 130.9,19.06 133.32,19.06 134.34,18.04 134.34,9.14 135.75,7.73 ; 32.66,35.55 32.66,35.6 ; 134.32,18.05 137.17,20.9 137.17,38.31 136.34,39.15
  Top Layer w0.22: 32.64,35.54 32.64,35.58 32.06,36.15 30.68,36.15
  Top Layer w0.226: 129.09,9.53 128.36,9.53 126.04,7.2 119.22,7.2 117.18,9.24 107.6,9.24 105.84,11 105.84,13.08 ; 136.34,39.15 119.35,39.15 118.71,38.5
  Bottom Layer w0.2: 99.31,39.46 99.32,39.47 99.86,39.47 102.26,37.07 117.23,37.07 118.71,38.55 ; 27.72,38.9 27.72,36.69 28.23,36.17 30.67,36.17 30.68,36.16
  Bottom Layer w0.3: 129.1,9.5 129.08,9.48 133.86,9.48 135.55,7.79 135.56,7.79
  vias: v1(27.72,38.88) v1(30.67,36.16) v1(99.3,39.45) v1(118.72,38.5) v1(129.09,9.51)
P1-1: length 51.5
  Top Layer w0.2: 16.25,29.08 16.06,28.89 16.06,18.73 14.26,16.92 9.06,16.92 8.93,16.8 8.93,15.01 21.33,15.01 21.33,28.83 21.05,29.1 16.29,29.1
P2-1: length 5.4
  Top Layer w0.226: 102.59,10.76 102.6,10.76
  Top Layer w0.251: 102.6,10.76 103.8,10.76 105.28,9.28 105.28,7.18
P5-3: length 76.8
  Top Layer w0.226: 119.39,8.39 118.03,9.76 108.03,9.76 107.5,10.29 107.48,10.29
  Top Layer w0.251: 51.39,6.73 51.55,6.89
  Top Layer w0.276: 107.51,4.62 51.78,4.62 51.39,5.01 51.39,6.73
  Bottom Layer w0.251: 107.5,10.3 107.45,10.26 107.45,4.64 107.54,4.55
  vias: v1(107.5,10.3) v1(107.52,4.56)
P6-1: length 3.8
  Top Layer w0.276: 133.98,36.66 134.02,36.66 135.61,35.07 135.61,33.54
P7-1: length 7.9
  Top Layer w0.251: 112.09,11.33 112.09,11.34 112.09,12.46
  Bottom Layer w0.276: 112.04,12.44 112.04,10.63 115.53,7.14 115.54,7.14
  vias: v1(112.07,12.5)
P14-6: length 12.9
  Top Layer w0.2: 132.6,18.23 131.13,16.76 127.15,16.76 126.3,17.61 123.82,17.61 123.2,16.99 120.96,16.99 120.92,17.03
P14-8: length 15.2
  Top Layer w0.2: 121.1,14.92 121.1,14.96 122.7,16.56 123.38,16.56 123.98,17.16 125.94,17.16 126.15,16.95 126.15,14.63 126.52,14.26 131.14,14.26 132.33,15.45
Q1-1: length 4.2
  Top Layer w0.251: 131.59,37.67 129.56,37.67 129.54,37.69 129.54,35.57 129.57,35.53
Q2-1: length 3.7
  Top Layer w0.251: 95.92,23.8 95.87,23.84 95.86,23.86 95.86,27.44
Q2-3: length 5.6
  Top Layer w0.251: 96.84,35.44 96.84,29.89 96.79,29.84
Q3-1: length 8
  Top Layer w0.2: 33.21,19.23 33.21,19.23 31.29,21.16 31.29,22.7
  Top Layer w0.428: 33.65,24.6 32.15,24.6 31.96,24.41 31.96,23.34 31.36,22.73 31.36,22.73
Q4-3: length 3.4
  Top Layer w0.2: 32.85,21.75 32.85,21.11 34.78,19.18 34.78,19.16
R1-1: length 414.3
  Top Layer w0.226: 3.42,27.6 3.42,27.5 4.29,26.62 5.09,26.62 5.38,26.33 5.38,21.61 7.7,19.29 7.7,13.26 8.08,12.87 17.93,12.87 ; 126.02,10.5 126.07,10.45
  Top Layer w0.251: 93.77,28.42 94.25,27.94 94.25,17.38 96.03,15.6 96.03,15.53 ; 100.2,7.04 100.43,7.04 ; 83.13,25.73 82.5,25.73 82.27,25.97 82.27,27.97 82.76,28.46 82.76,28.5 ; 98.2,7.04 100.14,7.04 ; 98.2,7.05 94.65,10.6 94.65,13.21 95.01,13.57 96.03,13.57 ; 126.07,10.45 129.08,10.45 ; 68.45,25.66 67.89,25.66 67.57,25.99 67.57,28.62 68.74,29.79 68.74,32.58 68.39,32.92 65.96,32.92 65.14,33.74 65.14,36.86 ; 53.64,25.64 53.13,25.64 52.88,25.89 52.88,28.56 54.28,29.96 54.28,32.63
  Top Layer w0.276: 57.68,32.61 57.73,32.66 ; 71.86,36.81 71.83,36.78 71.83,34.84 72.09,34.84 73.13,33.79 73.13,32.72 ; 88.89,32.8 87.01,32.8 86.83,32.98 86.83,34.86 86.62,35.07 86.62,36.71 ; 72.08,32.65 72.13,32.7 74.29,32.7 ; 96.09,13.51 96.03,13.57 ; 58.48,32.7 58.48,33.8 57.39,34.89 57.39,36.79 57.4,36.8
  Top Layer w0.301: 57.73,32.66 59.45,32.66
  Top Layer w0.428: 93.74,33.33 93.74,28.44 93.77,28.42
  Top Layer w0.454: 17.75,1.6 17.71,1.64 15.86,1.64 ; 16.96,4.89 16.94,4.87 15.87,4.87
  Top Layer w0.53: 132.55,10.42 132.55,7.2 132.59,7.15 ; 132.74,6.89 132.76,6.89 ; 100.14,7.04 100.2,7.04 101.86,5.38 118.58,5.38 ; 132.31,23.06 132.33,23.08 134.81,23.08 135.65,23.92 135.65,30.99 ; 110.62,5.51 110.62,7.04 110.57,7.09
  Top Layer w0.555: 95.96,15.35 95.96,13.74 95.97,13.73 ; 133.26,5.3 133.26,6.39 132.76,6.89
  Top Layer w0.6: D9.2 127.99,23.1 129.84,23.1
  Top Layer w0.708: 46.65,17.27 46.76,17.27 48.84,19.36 49.86,19.36 50.12,19.61 50.06,19.66 50.06,22.13 48.56,23.63 38.97,23.63 35.22,27.38 35.08,27.38 33.72,26.02 30.96,26.02 30.31,25.38 30.31,24.61 29.38,23.67 29.38,22.6 ; 91.51,35.56 91.42,35.56 90.14,36.84 50.4,36.84 49.47,35.91 49.47,25.52 48.74,24.79 37.99,24.79
  Top Layer w0.734: 18.06,1.7 18.12,1.64 20.08,1.64 ; 23.53,14.9 23.53,26.02
  Top Layer w0.886: 45.88,20.97 45.88,19.44 46.65,18.67 46.65,17.27
  Top Layer w0.962: 17.96,12.89 19.83,12.89
  Bottom Layer w0.276: 93.51,28.33 93.73,28.47 ; 93.51,28.33 93.51,28.32 ; 93.51,28.33 93.73,28.43 ; 93.51,28.33 93.4,28.25 ; 93.4,28.25 93.6,28.25 93.73,28.39 ; 93.4,28.25 86.34,28.25 85.91,27.82 83.36,27.82 82.71,28.48
  Bottom Layer w0.3: 132.56,10.53 132.49,10.46 129.12,10.46
  Bottom Layer w0.301: 58.49,32.67 58.45,32.63 54.3,32.63 54.3,32.63
  Bottom Layer w0.454: 15.75,4.89 15.75,1.76 15.7,1.72
  Bottom Layer w0.478: 134.68,15.04 132.5,12.86 132.5,10.54
  Bottom Layer w0.503: 129.87,23.06 132.76,23.06 132.8,23.08 132.83,23.11 133.76,23.11 134.68,22.19 134.68,15.04
  Bottom Layer w0.528: 118.55,5.35 118.55,6.9 119.17,7.52 124.31,7.52 126.55,5.27 133.16,5.27
  Bottom Layer w0.581: 23.58,26.03 31.47,26.03
  Bottom Layer w0.732: 135.59,30.88 135.63,30.92 138.12,30.92 139.02,31.83 139.02,36.85 138.14,37.73 123.23,37.73 118.92,33.42 93.7,33.42 91.58,35.55
  Bottom Layer w0.886: 23.54,14.88 23.54,13.56 22.89,12.91 19.82,12.91
  Bottom Layer w0.911: 17.88,12.92 14.58,12.92 13.64,11.98 13.64,2.5 14.42,1.72 15.67,1.72
  vias: v1(15.83,4.88) v1(15.81,1.64) v1(17.89,12.93) v1(19.87,12.84) v1(23.53,25.98) v1(23.51,14.89) v1(31.55,26.01) v1(54.27,32.65) v1(58.48,32.67) v1(82.73,28.46) v1(93.75,33.37) v1(93.75,28.42) v1(118.61,5.36) v1(129.1,10.46) v1(132.54,10.5) v1(133.2,5.36)
R1-2: length 5.8
  Top Layer w0.2: 3.35,29.27 3.35,29.39 4.41,30.45 4.41,33.53 3.61,34.33
R2-1: length 285.2
  Top Layer w0.2: 4.89,27.68 5.81,26.75 5.81,21.86 8.15,19.53 8.15,18.42 8.67,17.9 13.42,17.9 14.52,19 14.53,19
  Top Layer w0.226: 87.05,21.64 87.05,21.26 87.8,20.51 87.8,20.46 ; 84.02,21.81 84.02,20.97 83.58,20.53 ; 57.7,21.53 57.7,21.12 58.38,20.45 58.38,20.42 ; 54.24,20.42 54.24,20.42 54.69,20.87 54.69,21.54
  Top Layer w0.251: 68.9,20.43 68.9,20.46 69.35,20.91 69.35,21.62 ; 73.13,20.43 73.12,20.43 72.37,21.18 72.37,21.6 ; 83.58,20.48 83.58,20.53
  Top Layer w0.352: 66.2,13.93 63.04,13.93 62.97,13.86
  Top Layer w0.505: 92.17,13.98 92.18,13.99
  Top Layer w0.53: 83.8,20.69 83.02,19.91 83.02,18.14 82.82,17.94 ; 62.87,13.91 62.96,14 62.96,15.86 64.25,17.16 64.25,23.75 63.06,24.95 ; 68.29,17.42 68.29,19.85 69.11,20.68 ; 80.82,13.95 77.68,13.95 77.61,14.02 ; 87.58,20.71 92.35,15.94 92.35,14.01 92.36,14 ; 92.18,13.99 93.24,13.99 93.83,13.4 93.83,10.64 93.33,10.13 ; 62.97,15.84 62.96,15.84 58.16,20.65 ; 92.36,15.97 92.38,15.97 93.53,17.11 93.53,23.84 92.4,24.98 ; 77.6,15.84 77.6,15.9 72.82,20.68 ; 77.58,14.16 77.63,14.21 77.63,15.88 78.92,17.17 78.92,23.66 77.59,25 ; 54.4,20.59 53.48,19.67 53.48,17.38 53.46,17.36
  Top Layer w0.886: 66.36,9.41 66.36,15.35 68.24,17.23
  Top Layer w0.911: 47.59,6.57 50.03,9.02 51.66,9.02 51.66,15.38 53.32,17.04 53.32,17.05
  Top Layer w1.115: 56.46,8.77 56.46,7.15 56.44,7.13
  Top Layer w1.14: 82.68,17.16 81.04,15.52 81.04,9.29 80.93,9.19 ; 93.2,10.05 92.15,9.01 68.59,9.05 51.77,9.05
  Bottom Layer w0.251: 18.8,10.54 18.93,10.67 18.93,18.77 18.67,19.03 14.53,19.03
  Bottom Layer w0.3: 16.68,7.71 16.07,7.71 16.07,11.44 55.1,11.44 57.16,9.38 57.16,6.14 55.63,6.14 55.63,8.27 55.4,8.5 22.91,8.5 22.12,7.71 16.31,7.71
  vias: v1(14.5,18.99)
R2-2: length 8.2
  Top Layer w0.2: 3.66,35.68 3.66,36.16 ; 4.91,29.28 4.9,29.3 4.9,34.42 3.53,35.78 3.53,36.41
R9-1: length 30.8
  Top Layer w0.2: 26.43,19.04 26.48,19.09 27.63,19.09 ; 26.35,19.06 26.38,19.09
  Top Layer w0.226: 26.35,19.06 25.22,19.06 24.94,18.78 24.94,14.68 24.27,14 22.13,14 21.53,13.4 21.53,8.8 arc(21.42,8.24) 21.1,7.77 21.1,7.76 arc(20.48,7.35) 19.75,7.21 19.42,7.21 ; 36.94,19.91 36.94,20.99 35.5,20.99 35.33,20.82
  Bottom Layer w0.251: 27.61,19.09 27.61,19.12 28.38,19.9 36.93,19.9
  vias: v1(27.63,19.06) v1(36.92,19.9)
R15-1: length 106.1
  Top Layer w0.2: 24.72,36.18 24.62,36.08 24.62,34.56 24.63,34.55
  Top Layer w0.22: 98.63,36.17 97.25,37.55 32.38,37.55 31.6,36.77 30.71,36.77 30.64,36.85
  Top Layer w0.226: 106.83,21.88 106.83,20.69 106.41,20.26 106.39,20.26 ; 28.94,36.77 27.44,36.77 26.85,36.18 24.72,36.18
  Top Layer w0.251: 104.25,35.07 105.16,34.16 105.16,31.2 106.69,29.67 106.69,28.41 110.9,24.2 110.9,21.46 110.89,21.45
  Bottom Layer w0.2: 30.64,36.8 29.06,36.8 29,36.73
  Bottom Layer w0.226: 98.6,36.16 98.6,36.16 100.67,36.16 101.53,35.3 104.04,35.3 104.27,35.07
  Bottom Layer w0.276: 110.86,21.47 107.56,21.47 106.43,20.35 106.43,20.24
  vias: v1(28.95,36.76) v1(30.65,36.83) v1(98.6,36.18) v1(104.25,35.06) v1(106.4,20.26) v1(110.89,21.46)
R29-2: length 6
  Top Layer w0.276: 55.71,34.77 54.41,33.46 52.13,33.46 51.79,33.8 51.79,35.03 51.7,35.12
R30-2: length 4.9
  Top Layer w0.276: 81.24,35.13 82.25,36.13 84.03,36.13 84.98,35.19 84.98,34.83
R31-1: length 224.3
  Top Layer w0.2: 30.65,37.59 30.65,37.63 31.4,38.38 98.19,38.38 99.19,37.38 99.19,33.19 ; 121.13,24.89 121.25,24.89 122.3,23.83 122.3,19.82 ; 99.26,35.66 99.39,35.66 ; 99.24,35.74 99.43,35.74
  Top Layer w0.226: 1.48,27.65 0.48,28.65 0.48,30.18 0.92,30.62 2.01,30.62 2.66,31.26 2.66,36.79 3.15,37.27 26.66,37.27 26.96,37.58 28.97,37.58 28.98,37.59 ; 109.36,13.42 109.36,18.74
  Top Layer w0.251: 99.2,33.1 99.22,33.11 99.22,35.46 99.48,35.72 101.08,35.72 ; 109.32,14.84 102.27,14.84 102.27,13.77 101.69,13.19 99.88,13.19 99.87,13.17 ; 100.04,20.85 100.04,20.9 101.03,21.9 103.83,21.9 103.83,19.74 104.31,19.27 108.82,19.27 109.34,18.75 110.87,18.75 ; 109.34,18.75 109.36,18.74 ; 99.98,20.74 99.98,20.9 99.31,21.57 97.63,21.57 ; 108.83,19.27 108.83,19.74 108.68,19.9 108.64,19.9
  Top Layer w0.276: 128.3,5.19 130.04,6.93 130.04,7.25 131.85,5.45 131.85,2.01 132.08,1.77 ; 101.08,35.72 101.28,35.92 105.16,35.92 105.66,35.42 105.66,31.43 107.2,29.89 107.2,28.64 109.5,26.34 110.88,26.34
  Top Layer w0.301: 112.83,19.85 112.81,19.88 112.81,25.65 112.16,26.31
  Top Layer w0.886: 130.19,7.28 130.24,7.33 130.24,12.37 130.09,12.52 ; 124.96,12.94 124.96,13.01 ; 124.96,12.94 124.96,12.59 ; 124.96,12.94 125.17,12.94 ; 124.96,12.94 124.91,12.94 ; 125.17,12.94 129.83,12.94 ; 125.17,12.94 125.17,14.73
  Bottom Layer w0.2: 30.63,37.59 28.94,37.59 28.93,37.6
  Bottom Layer w0.301: 112.1,26.34 110.89,26.34 110.88,26.33
  Bottom Layer w0.961: 125.14,14.36 125.14,18.52 123.81,19.84 108.7,19.84
  vias: v1(28.93,37.58) v1(30.64,37.59) v1(108.62,19.85) v1(110.87,26.34) v1(112.11,26.3) v1(112.81,19.83) v1(122.25,19.81) v1(125.19,14.33)
R31-2: length 4
  Top Layer w0.2: 1.5,29.36 1.5,29.36 3.5,31.36 3.5,32.5
R42-2: length 6.2
  Top Layer w0.276: 70.33,34.8 70.46,34.92 70.46,35.81 70.16,36.11 66.71,36.11 66.46,35.86 66.46,34.9
R51-2: length 146.4
  Top Layer w0.2: 119.21,37.13 119.19,37.13 118.83,36.77 118.83,26.81 119.64,25.99 121.6,25.99 122.79,24.8 122.79,19.1 121.96,18.27 118.1,18.27 117.12,17.3 117.12,15.94 ; 99.36,38.79 99.03,38.79 98.64,39.17 30.1,39.17 29.63,38.69 29.63,30.56 29.87,30.32
  Top Layer w0.251: 102.36,17.32 106.54,17.32 107.67,16.19 108.23,16.19 108.24,16.18
  Top Layer w0.276: 117.12,15.94 117.17,15.9 118.6,15.9 119.45,15.05
  Bottom Layer w0.2: 119.18,37.09 118.67,36.59 102.08,36.59 99.83,38.84 99.4,38.84 99.35,38.79
  Bottom Layer w0.276: 117.09,15.91 117.09,15.92 116.81,16.2 108.2,16.2
  vias: v1(99.34,38.78) v1(108.21,16.18) v1(117.11,15.9) v1(119.2,37.12)
R52-2: length 142.6
  Top Layer w0.2: 119.72,36.71 119.72,36.71 119.28,36.27 119.28,26.98 119.84,26.41 121.81,26.41 123.22,24.99 123.22,18.92 122.14,17.83 120.3,17.83 119.55,17.08 ; 99.34,38.14 99.08,38.14 98.44,38.78 30.37,38.78 30.09,38.5 30.09,31.92 31.48,30.52 31.48,30.31
  Top Layer w0.251: 102.36,17.79 107.36,17.79 108.18,16.97
  Top Layer w0.276: v1(117.76,16.91) 119.51,16.91
  Bottom Layer w0.2: 119.7,36.72 119.13,36.15 101.92,36.15 99.92,38.16 99.28,38.16
  Bottom Layer w0.276: 108.18,16.97 108.21,16.93 117.77,16.93
  vias: v1(99.3,38.16) v1(108.19,16.96) v1(119.69,36.71)
U1-1: length 15.8
  Top Layer w0.682: 43.29,6.6 43.19,6.7 43.19,12.62 39.67,16.14
  Top Layer w0.886: 40.88,20.4 40.81,20.34 40.81,19.19 39.67,18.04 39.67,16.14
U4-5: length 13.9
  Top Layer w0.251: 119.55,19.29 117.81,19.29 115.3,16.78 111.02,16.78 ; 115.58,12.6 115.58,16.49 115.31,16.77 115.25,16.77
U4-6: length 12.8
  Top Layer w0.251: 110.87,17.28 114.69,17.28 115.59,18.18 115.59,21.69 115.76,21.69
  Top Layer w0.276: 115.76,21.69 116.42,21.02 119.57,21.02
U4-7: length 16.3
  Top Layer w0.251: 119.49,24.99 119.49,22.93 119.48,22.92 ; 119.44,24.14 114.49,24.14 114.2,23.84 114.2,18.37 113.59,17.76 111.03,17.76
U4-17: length 11.6
  Top Layer w0.2: 105.95,24 105.96,23.98 106.99,23.98 107.32,23.65 107.32,22.12
  Top Layer w0.251: 103.56,24 97.69,24 97.52,23.83
  Bottom Layer w0.276: 103.57,23.97 105.97,23.97
  vias: v1(103.59,23.97) v1(105.97,24)
U4-19: length 38.2
  Top Layer w0.2: 128,37.67 127.97,37.7 118.82,37.7 118.39,37.28 118.39,27.27 118.09,26.97 111.88,26.97 111.5,26.58 111.5,22.03 ; 106.37,23.24 106.33,23.2 106.33,22.28
  Bottom Layer w0.226: 111.53,22.08 111.52,22.07 107.4,22.07 106.31,23.16
  vias: v1(106.35,23.18) v1(111.5,22.07)
U4-20: length 10
  Top Layer w0.226: 105.82,21.88 105.82,20.63 105.43,20.24 105.37,20.24 ; 97.57,19.58 97.62,19.58
  Top Layer w0.251: 97.62,19.58 98.3,20.26 98.87,20.26
  Bottom Layer w0.276: 105.42,20.3 105.34,20.23 98.92,20.23 98.88,20.27
  vias: v1(98.89,20.24) v1(105.38,20.26)
U4-21: length 12.5
  Top Layer w0.2: 101.98,32.98 102.79,32.17 102.79,30.23 103.79,29.23 103.79,28.2 105.34,26.65 105.34,21.85
U4-22: length 9.9
  Top Layer w0.2: 101.78,30.64 101.78,30.6 103.2,29.18 103.2,28.12 104.85,26.46 104.85,21.99
U4-28: length 22.6
  Top Layer w0.226: 101.99,18.8 99.94,18.8 98.7,17.56 97.76,17.56 97.64,17.45 97.64,15.51 98.77,14.38 98.77,12.71 99.41,12.07 103.27,12.07 ; 110.5,11.35 110.48,11.37 109.3,11.37
  Bottom Layer w0.2: 109.39,11.33 109.39,11.34 108.64,12.09 103.18,12.09
  vias: v1(103.2,12.06) v1(109.36,11.36)
U4-29: length 30
  Top Layer w0.251: 102.34,18.3 107.77,18.3 108.87,17.2 108.87,15.62 108.7,15.46 108.25,15.46 108.24,15.44 ; 119.52,10.67 119.52,10.33 120.12,9.72 122.86,9.72 123.07,9.51
  Bottom Layer w0.226: 120.1,9.73 120.03,9.79 120.03,13.65 119.35,14.34 114.93,14.34 113.82,15.45 108.19,15.45
  vias: v1(108.22,15.42) v1(120.1,9.74)
U4-34: length 37.3
  Top Layer w0.251: 106.52,15.81 102.44,15.81 ; 126.89,7.14 126.88,7.14 126.88,4.9 126.93,4.85 126.93,1.92
  Bottom Layer w0.226: 126.89,7.1 126.91,7.11 126.91,8.54 126.46,8.98 119.75,8.98 119.34,9.39 119.34,13.49 118.93,13.9 107.18,13.9 106.49,14.59 106.49,15.83
  vias: v1(106.5,15.79) v1(126.89,7.13)
U4-37: length 37.9
  Top Layer w0.251: 103.82,13.14 103.82,11.94 107.02,8.75 116.98,8.75 ; 130.16,4.97 130.21,4.92 130.21,2.51 129.68,1.97 129.68,1.97 ; 129.52,1.81 129.52,1.82
  Top Layer w0.276: 116.98,8.75 119.08,6.65 123.65,6.65 125.61,4.69 125.61,0.53 128.24,0.53 129.52,1.81
U4-44: length 16.6
  Top Layer w0.251: 119.47,12.88 119.44,12.91 118.01,12.91 117.5,12.4 117.5,10.61 117.11,10.22 108.64,10.22 107.34,11.52 107.34,13.27
U4-46: length 18.9
  Top Layer w0.226: 97.68,13.77 97.62,13.72 97.62,11.59 97.73,11.48 98.76,11.48 ; 97.66,11.61 97.62,11.58 97.62,10.98 97.8,10.8 100.97,10.8
  Top Layer w0.251: 108.35,13.26 108.35,11.44 108.34,11.43
  Bottom Layer w0.251: 98.81,11.44 108.37,11.44 108.38,11.45
  vias: v1(98.78,11.45) v1(108.37,11.45)
U5-1: length 20.3
  Top Layer w0.226: 59.42,22.32 59.13,22.61 58.76,22.61
  Top Layer w0.53: 61.17,19.25 61.17,19.28 59.43,21.03 59.43,22.27
  Bottom Layer w0.884: 61.14,19.27 61.14,15.04 69.12,7.06 69.36,7.06
  vias: v3(61.19,19.23)
U5-2: length 72.6
  Top Layer w0.2: 58.72,23.13 59.67,23.13 ; 105.97,24.78 107.19,24.78 107.84,24.12 107.84,22.18
  Top Layer w0.226: 89.55,21.36 89.55,22.79 89.14,23.2 88.03,23.2
  Top Layer w0.251: 89.55,21.36 90.43,20.48 92.73,20.48 ; 95.05,22.51 95.96,21.6 95.96,21.49 ; 74.24,23.17 74.22,23.15 73.38,23.15
  Bottom Layer w0.251: 92.7,20.48 92.7,22.08 93.08,22.46 95.03,22.46 95.05,22.48 95.05,23.79 95.33,24.07 102.37,24.07 103.08,24.79 106.02,24.79 ; 59.61,23.16 59.62,23.16
  Bottom Layer w0.276: 59.61,23.16 59.61,26.83 60.12,27.34 88.9,27.34 89.35,26.88 89.35,23.57 88.93,23.15 ; 74.22,23.19 74.3,23.27 74.3,27.24
  vias: v1(59.63,23.17) v1(74.23,23.16) v1(88.93,23.2) v1(92.73,20.47) v1(95.05,22.47) v1(105.98,24.79)
U5-4: length 4.9
  Top Layer w0.226: 61.45,21.85 61.45,22.35 59.68,24.12 58.83,24.12 ; 61.36,21.88 61.36,22.37 ; 61.35,21.85 61.35,22.45
U5-5: length 5.8
  Top Layer w0.226: 63.05,21.98 63.05,22.62 62.57,23.09 61.5,23.09 59.97,24.62 58.73,24.62
U5-6: length 2.6
  Top Layer w0.226: 58.77,25.14 61.33,25.14
U5-8: length 3.9
  Top Layer w0.251: 61.47,27.07 61.05,26.65 57.75,26.65
U5-9: length 8.8
  Top Layer w0.2: 56.93,27.85 56.93,28.06
  Top Layer w0.226: 56.17,26.75 56.17,27.6 56.36,27.79 57.02,27.79 57.2,27.61 57.2,26.66
  Top Layer w0.251: 59.48,31.06 59.48,30.62 56.66,27.79 ; 56.68,26.7 56.68,27.77 ; 56.87,27.81 56.87,27.93
U5-12: length 8.4
  Top Layer w0.226: 57.44,30.94 57.44,29.84 55.98,28.37 55.98,28.35 55.69,28.07 55.69,26.63 ; 54.38,28.36 54.38,28.35 54.67,28.06 54.67,26.77
  Bottom Layer w0.301: 54.37,28.32 54.38,28.33 55.97,28.33
  vias: v1(54.38,28.34) v1(55.98,28.34)
U5-13: length 4
  Top Layer w0.251: 55.2,26.68 55.2,30.69
U5-16: length 74.2
  Top Layer w0.2: 106.1,29.29 106.1,28.31 110.24,24.16 110.24,20.92 110.42,20.74 111.88,20.74 112.13,20.5 112.13,19.4 112,19.27 110.84,19.27
  Top Layer w0.226: 53.03,29.89 53,29.89 52.08,28.97 52.08,25.89 52.84,25.14 53.71,25.14
  Bottom Layer w0.251: 106.03,29.3 105.47,29.86 53.01,29.86 53,29.86
  vias: v1(53,29.88) v1(106.07,29.27)
U5-17: length 9.3
  Top Layer w0.226: 51.25,25.52 52.15,24.62 53.62,24.62
  Top Layer w0.251: 51.25,25.52 51.25,29.63 52.95,31.33
U5-19: length 78.4
  Top Layer w0.2: 104.19,30.93 104.66,30.46 104.66,28.54 109.34,23.87 109.34,22.05
  Top Layer w0.251: 50.56,32.68 50.56,25.09 52.03,23.62 53.67,23.62
  Bottom Layer w0.226: 104.24,30.98 103.58,30.32 53.62,30.32 53.4,30.54 50.81,30.54 50.6,30.75 50.6,32.64 50.54,32.71
  vias: v1(50.56,32.66) v1(104.21,30.92)
